# EAGLE design IotaWatt (EAGLE 8.0.0)
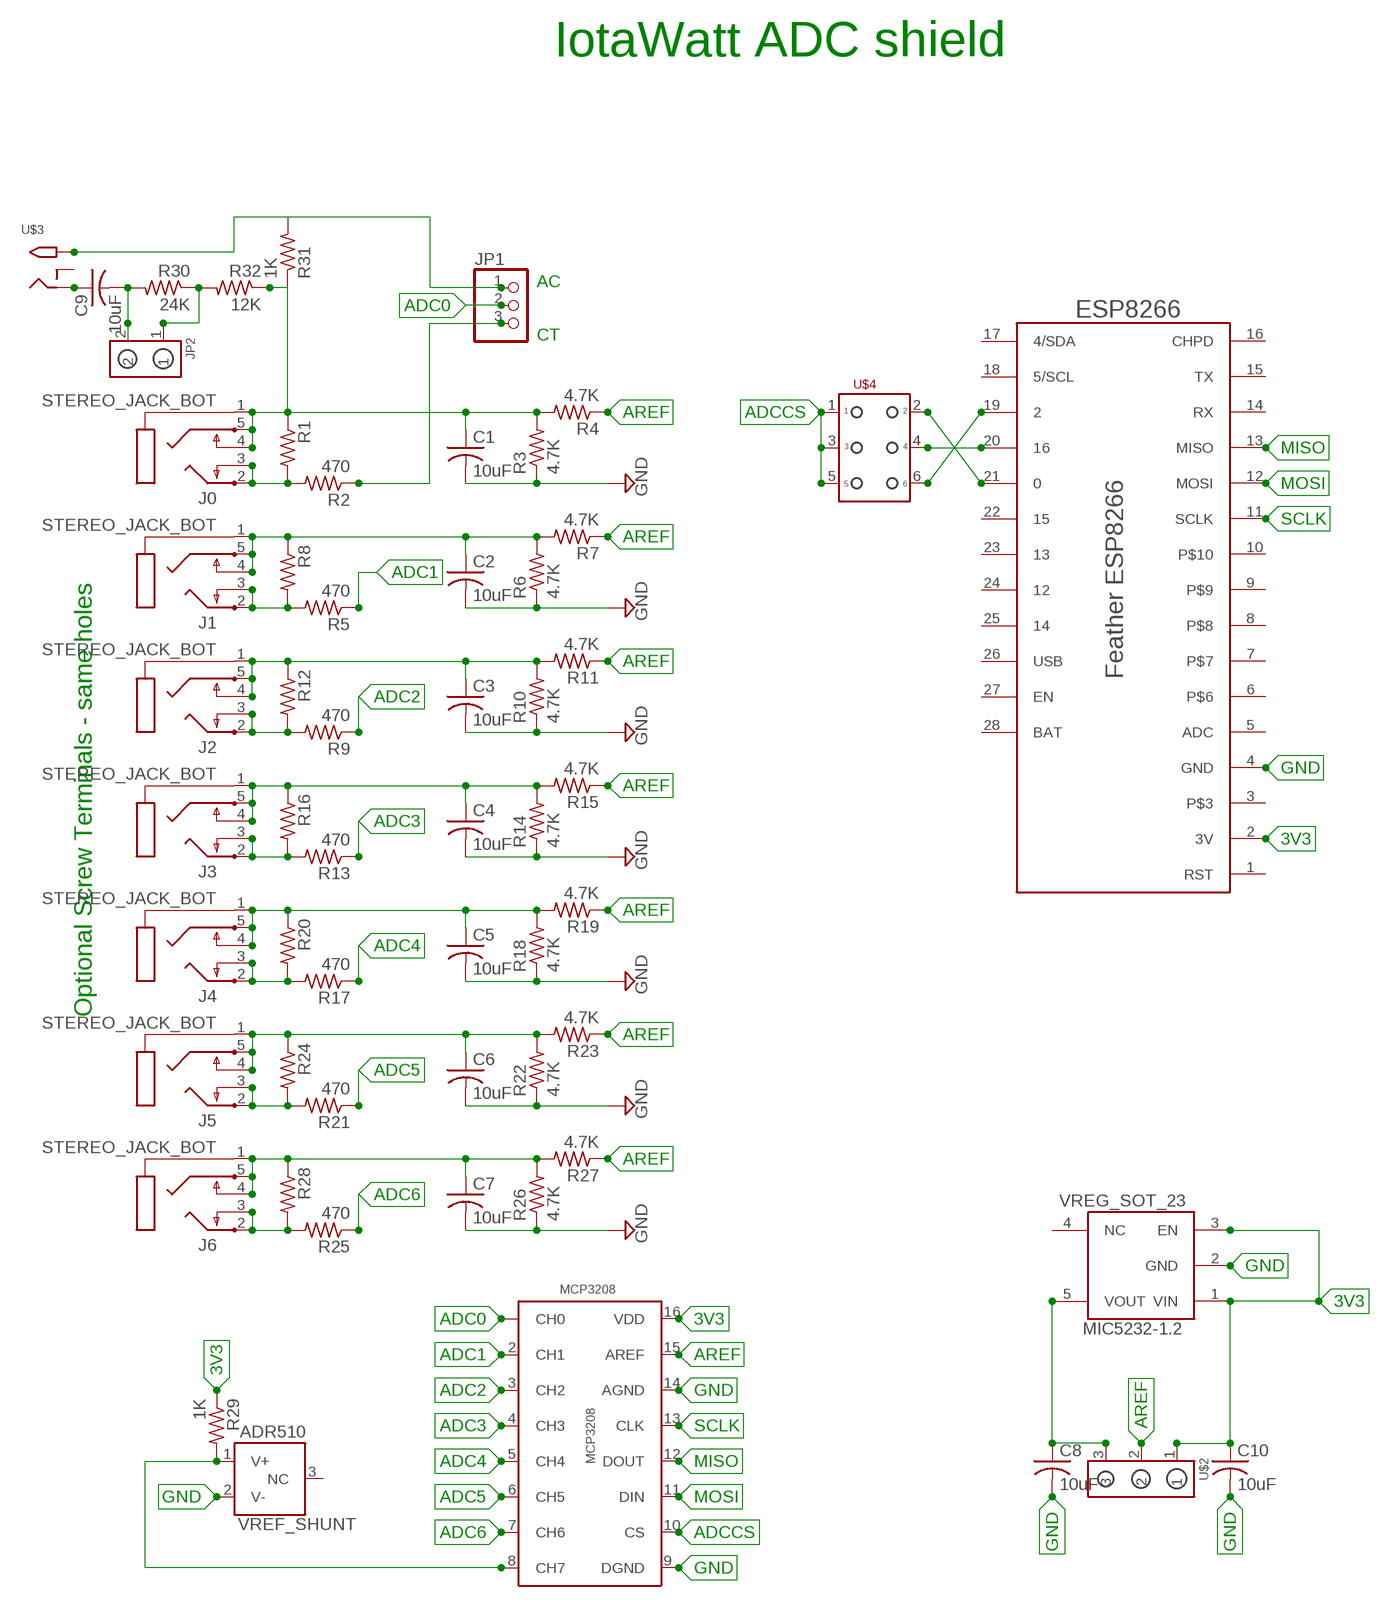
[diagram p0: schematic, sheet 1]

## Parts
ADR510  VREF_SHUNT  [SOT23_3]
C1  10uF  C-USC0805  [C0805]
C2  10uF  C-USC0805  [C0805]
C3  10uF  C-USC0805  [C0805]
C4  10uF  C-USC0805  [C0805]
C5  10uF  C-USC0805  [C0805]
C6  10uF  C-USC0805  [C0805]
C7  10uF  C-USC0805  [C0805]
C8  10uF  C-USC0805  [C0805]
C9  10uF  C-USC0805  [C0805]
C10  10uF  C-USC0805  [C0805]
J0  STEREO_JACK_BOT  [STX3100]
J1  STEREO_JACK_BOT  [STX3100]
J2  STEREO_JACK_BOT  [STX3100]
J3  STEREO_JACK_BOT  [STX3100]
J4  STEREO_JACK_BOT  [STX3100]
J5  STEREO_JACK_BOT  [STX3100]
J6  STEREO_JACK_BOT  [STX3100]
JP1  PINHD-1X3  [1X03]
JP2  HEADER_1X2  [HEADER_1X2]
MCP3208  MCP3208  [SOIC_16]
MIC5232-1.2  VREG_SOT_23  [SOT23_5]
R1  R-US_FLIPFLOP7  [0805-THM-7]
R2  470  R-US_R0805  [R0805]
R3  4.7K  R-US_R0805  [R0805]
R4  4.7K  R-US_R0805  [R0805]
R5  470  R-US_R0805  [R0805]
R6  4.7K  R-US_R0805  [R0805]
R7  4.7K  R-US_R0805  [R0805]
R8  R-US_FLIPFLOP7  [0805-THM-7]
R9  470  R-US_R0805  [R0805]
R10  4.7K  R-US_R0805  [R0805]
R11  4.7K  R-US_R0805  [R0805]
R12  R-US_FLIPFLOP7  [0805-THM-7]
R13  470  R-US_R0805  [R0805]
R14  4.7K  R-US_R0805  [R0805]
R15  4.7K  R-US_R0805  [R0805]
R16  R-US_FLIPFLOP7  [0805-THM-7]
R17  470  R-US_R0805  [R0805]
R18  4.7K  R-US_R0805  [R0805]
R19  4.7K  R-US_R0805  [R0805]
R20  R-US_FLIPFLOP7  [0805-THM-7]
R21  470  R-US_R0805  [R0805]
R22  4.7K  R-US_R0805  [R0805]
R23  4.7K  R-US_R0805  [R0805]
R24  R-US_FLIPFLOP7  [0805-THM-7]
R25  470  R-US_R0805  [R0805]
R26  4.7K  R-US_R0805  [R0805]
R27  4.7K  R-US_R0805  [R0805]
R28  R-US_FLIPFLOP7  [0805-THM-7]
R29  1K  R-US_R0805  [R0805]
R30  24K  R-US_R0805  [R0805]
R31  1K  R-US_R0805  [R0805]
R32  12K  R-US_R0805  [R0805]
U$1  ESP8266FEATHER  [FEATHERWING]
U$2  HEADER_1X3  [HEADER_1X3]
U$3  2.1MMJACKBOTTHM  [PJ-102A-BOT]
U$4  HEADER_2X3  [HEADER_2X3]

## Nets
3V3: C10.1 MCP3208.16(VDD) MIC5232-1.2.1(VIN) MIC5232-1.2.3(EN) R29.1 U$1.2(3V) U$2.1
ACV1: C9.2 JP2.2 R30.2
ACV2: JP2.1 R30.1 R32.2
ADC0: JP1.2 MCP3208.1(CH0)
ADC1: MCP3208.2(CH1) R5.1
ADC2: MCP3208.3(CH2) R9.1
ADC3: MCP3208.4(CH3) R13.1
ADC4: MCP3208.5(CH4) R17.1
ADC5: MCP3208.6(CH5) R21.1
ADC6: MCP3208.7(CH6) R25.1
ADC7: ADR510.1(V+) MCP3208.8(CH7) R29.2
ADCCS: MCP3208.10(CS) U$4.1 U$4.3 U$4.5
AREF: MCP3208.15(AREF) R4.1 R7.1 R11.1 R15.1 R19.1 R23.1 R27.1 U$2.2
GND: ADR510.2(V-) C1.2 C2.2 C3.2 C4.2 C5.2 C6.2 C7.2 C8.2 C10.2 MCP3208.9(DGND) MCP3208.14(AGND) MIC5232-1.2.2(GND) R3.1 R6.1 R10.1 R14.1 R18.1 R22.1 R26.1 U$1.4(GND)
MISO: MCP3208.12(DOUT) U$1.13(MISO)
MOSI: MCP3208.11(DIN) U$1.12(MOSI)
N$1: JP1.3 R2.1
N$2: C1.1 J0.1 J0.4 J0.5 R1.1 R3.2 R4.2 R31.1 R32.1
N$3: U$1.21 U$4.2
N$4: C2.1 J1.1 J1.4 J1.5 R6.2 R7.2 R8.1
N$5: J2.2 J2.3 R9.2 R12.2
N$6: U$1.19 U$4.6
N$7: C9.1 U$3.RING
N$8: JP1.1 R31.2 U$3.TIP
N$9: U$1.20 U$4.4
N$12: C3.1 J2.1 J2.4 J2.5 R10.2 R11.2 R12.1
N$13: C5.1 J4.1 J4.4 J4.5 R18.2 R19.2 R20.1
N$14: J5.2 J5.3 R21.2 R24.2
N$16: C6.1 J5.1 J5.4 J5.5 R22.2 R23.2 R24.1
N$17: J0.2 J0.3 R1.2 R2.2
N$18: J6.2 J6.3 R25.2 R28.2
N$19: C7.1 J6.1 J6.4 J6.5 R26.2 R27.2 R28.1
N$20: J1.2 J1.3 R5.2 R8.2
N$21: J3.2 J3.3 R13.2 R16.2
N$22: C4.1 J3.1 J3.4 J3.5 R14.2 R15.2 R16.1
N$24: C8.1 MIC5232-1.2.5(VOUT) U$2.3
N$26: J4.2 J4.3 R17.2 R20.2
SCLK: MCP3208.13(CLK) U$1.11(SCLK)
Unconnected: ADR510.3(NC) MIC5232-1.2.4(NC) U$1.1(RST) U$1.3 U$1.5(ADC) U$1.6 U$1.7 U$1.8 U$1.9 U$1.10 U$1.14(RX) U$1.15(TX) U$1.16(CHPD) U$1.17(4/SDA) U$1.18(5/SCL) U$1.22 U$1.23 U$1.24 U$1.25 U$1.26(USB) U$1.27(EN) U$1.28(BAT) U$3.RING_SW

## Notes on the sheet
- IotaWatt ADC shield
- AC
- CT
- Optional Screw Terminals - same holes

## Library data of the parts
ADR510 = IotaWatt_parts:VREF_SHUNT: Voltage Reference Shunt - SOT23-3 (ADR504, etc.)
C1-C10 = adafruit:C-US: CAPACITOR, American symbol
J0 J1-J6 = IotaWatt_parts:STEREO_JACK_BOT: Stereo Jack - Bottom Mount
JP1 = adafruit:PINHD-1X3: PIN HEADER
JP2 = IotaWatt_parts:HEADER_1X2: Header 1x2
MCP3208 = IotaWatt_parts:MCP3208: MCP3208 12bit SPI ADC
MIC5232-1.2 = IotaWatt_parts:VREG_SOT_23: Generic SOT23-3 Voltage Regulator (MIC5232, etc.)
R1-R32 = adafruit:R-US_: RESISTOR, American symbol
U$1 = IotaWatt_parts:ESP8266FEATHER: Adafruit ESP8266 Feather
U$2 = IotaWatt_parts:HEADER_1X3
U$3 = IotaWatt_parts:2.1MMJACKBOT: Bottom Mount 2.1mm x 5.5mm THM DC jack with internal switch. Digikey part #PJ-102A, 4UCON part #05537 2.1mm x 5.5mm SMT DC jack with internal switch. Digikey part #PJ-002A-SMT, 4UCON part #03267 By microbuilder.eu & adafruit.com
U$4 = IotaWatt_parts:HEADER_2X3: Header 2x3

## Board
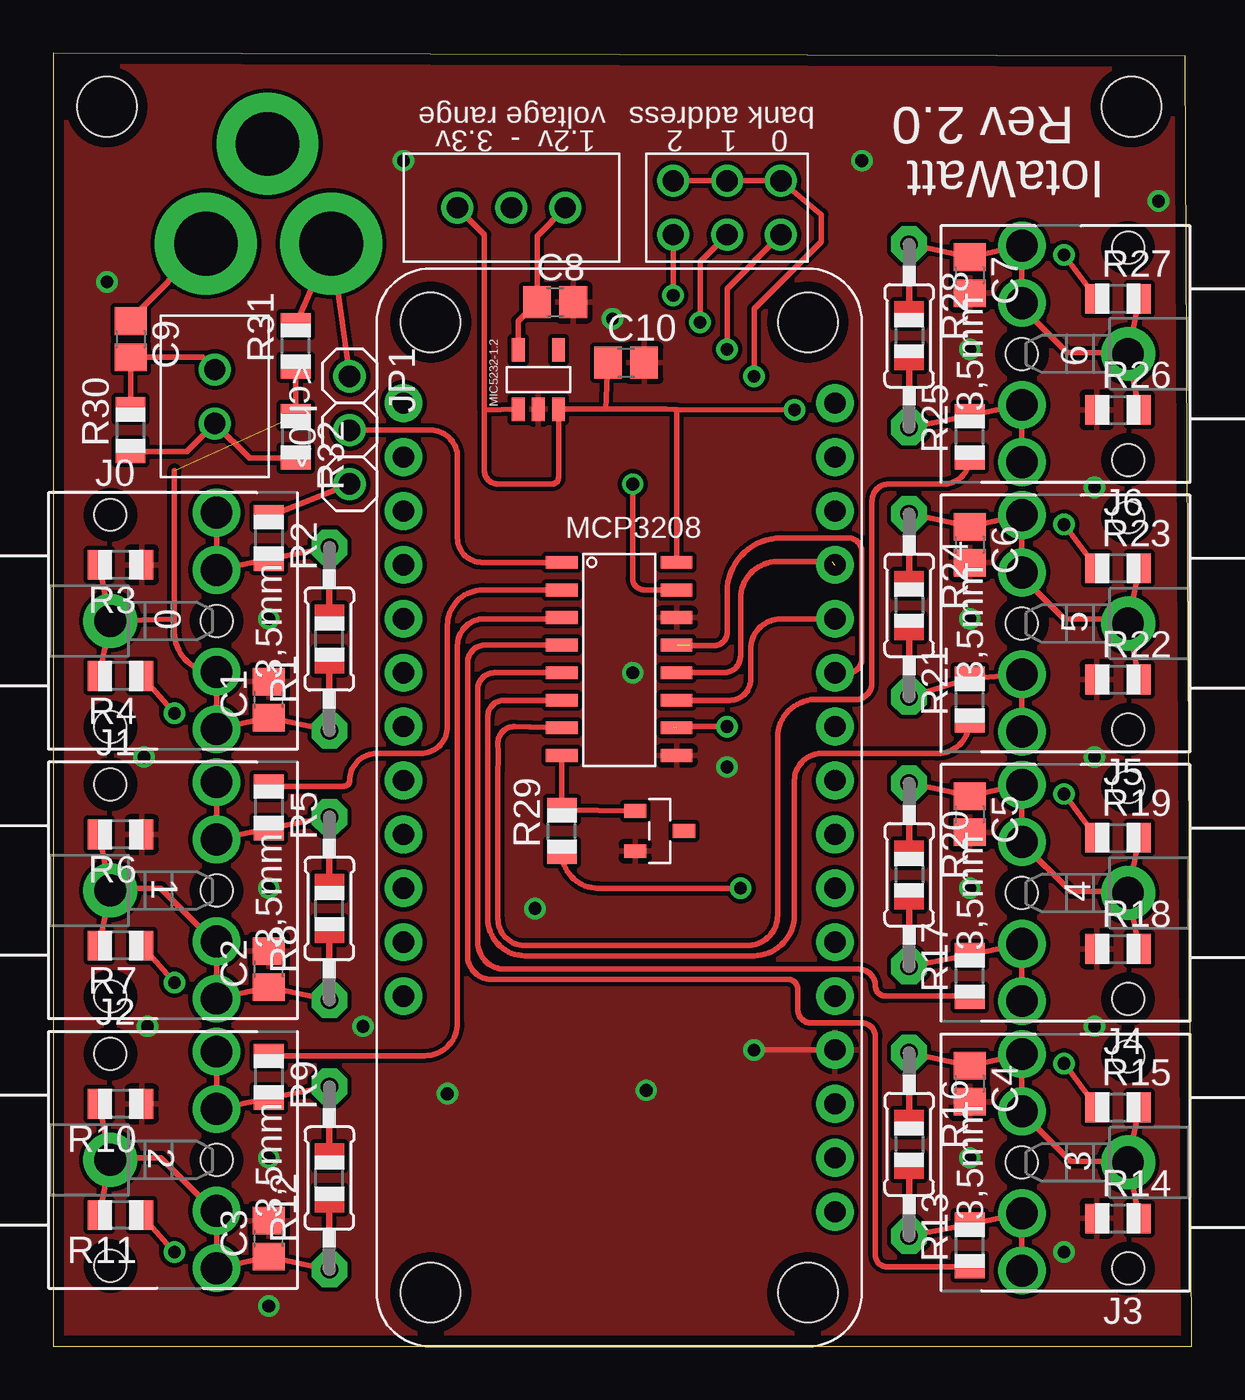
[diagram p1: board, top side]
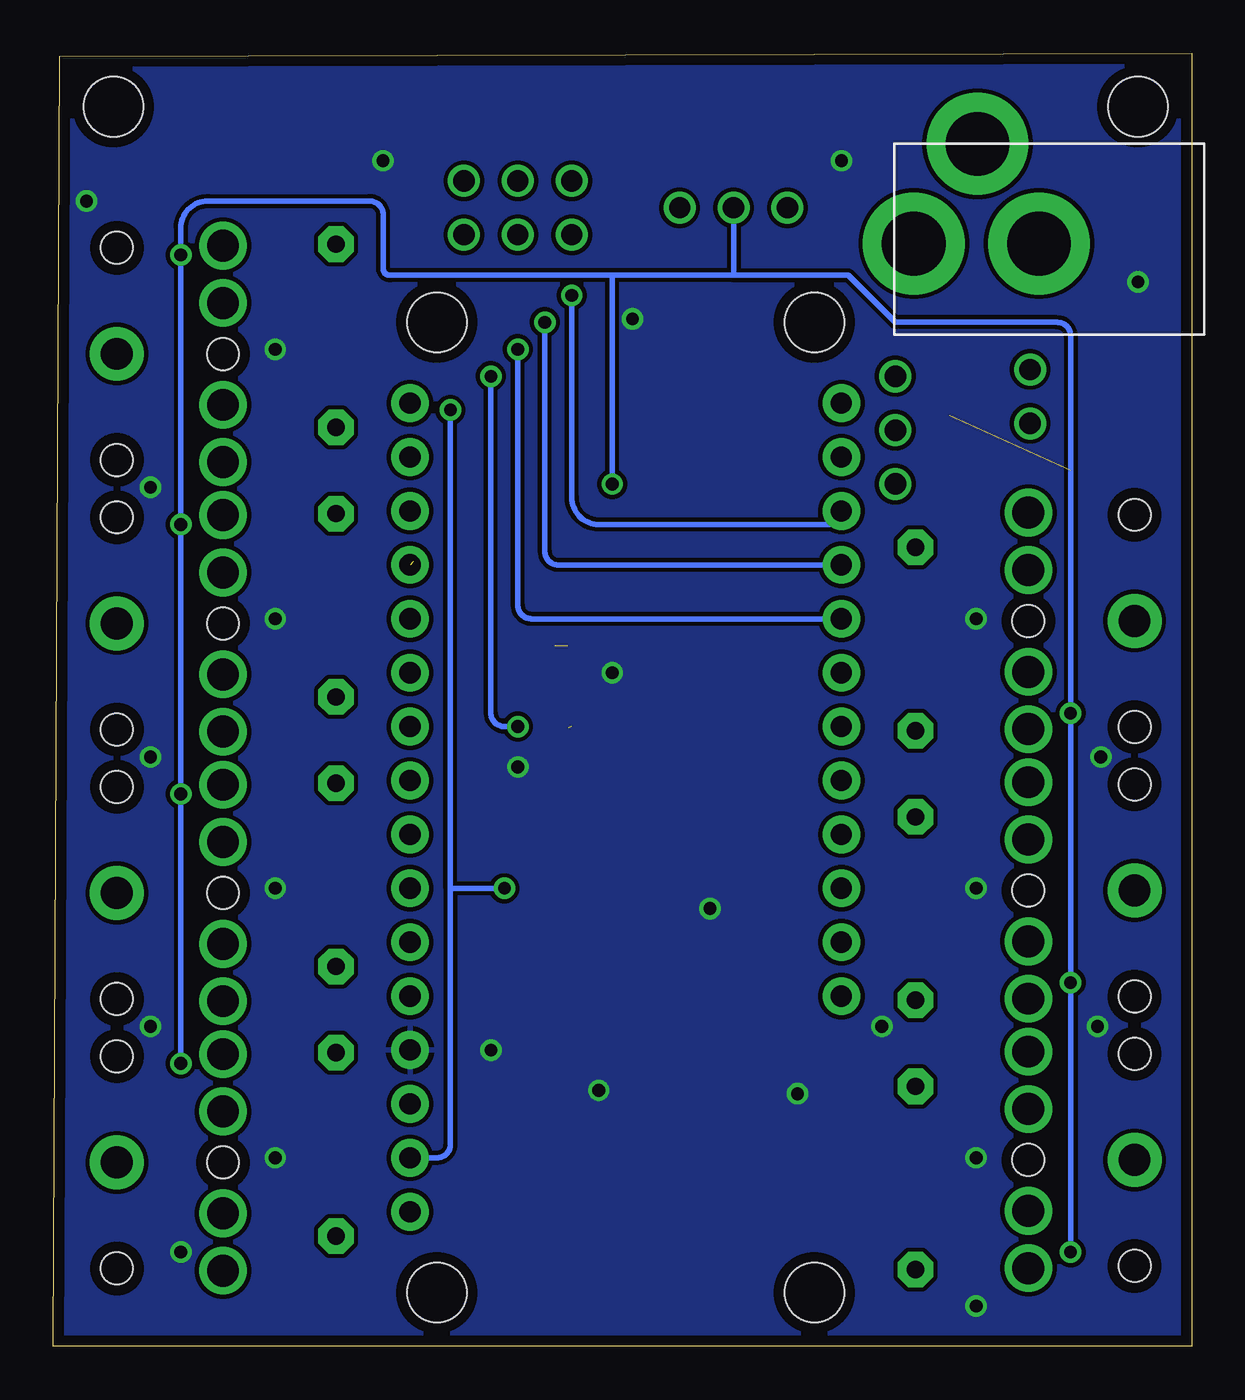
[diagram p2: board, bottom side, seen from below]

Size 53.65 x 60.95 mm. Coordinates in mm from the lower left corner, seen from the top.
Outline: 0,0 53.65,0 53.33,60.79 0,60.95 0,0
Copper layers (1*16): Top 0.035mm / dielectric 1.5mm / Bottom 0.035mm
Design rules "default *": minimum track width 10mil, minimum drill 10mil, track to track 8mil, track to pad 8mil, pad to pad 8mil, via to via 8mil, smd to smd 0mil, copper to edge 20mil, drill to drill 8mil, minimum pad ring 10mil, minimum via ring 8mil, stop-mask expansion 4mil, vias tented up to drill 0mil, thermal gap 10mil
Holes 2.8 mm at 17.78,2.54 35.56,2.54 17.78,48.26 35.56,48.26 2.54,58.42 50.8,58.42

### Footprints (pad centres in the part's own frame; a part is rotated, then mirrored left to right if it is on the bottom)
SOT23_3 = smd 1.05 x 0.65: 1 -1.15,0.95; 2 -1.15,-0.95; 3 1.15,0
C0805 = smd 1.3 x 1.5: 1 -0.85,0; 2 0.85,0
STX3100 = drill 1.5 pad 2.54: 1 2.7,-0.1 | drill 1.5: 2 7.7,5; 3 7.7,2.3; 4 7.7,-2.5; 5 7.7,-5.2 | hole 1.5: 2.7,4.9; 2.7,-5.1; 7.7,-0.1
1X03 = drill 1.016: 1 -2.54,0; 2 0,0; 3 2.54,0
HEADER_1X2 = drill 1: 1 0,2.54; 2 0,0
SOIC_16 = smd 1.5 x 0.6: 1 -2.7,5.2; 2 -2.7,3.9; 3 -2.7,2.6; 4 -2.7,1.3; 5 -2.7,0; 6 -2.7,-1.3; 7 -2.7,-2.6; 8 -2.7,-3.9; 9 2.7,-3.9; 10 2.7,-2.6; 11 2.7,-1.3; 12 2.7,0; 13 2.7,1.3; 14 2.7,2.6; 15 2.7,3.9; 16 2.7,5.2
SOT23_5 = smd 1.1 x 0.6: 1 -1.4,0.95; 2 -1.4,0; 3 -1.4,-0.95; 4 1.4,-0.95; 5 1.4,0.95
0805-THM-7 = drill 0.813 pad 1.676 octagon: 1 -4.318,0; 2 4.318,0
R0805 = smd 1.1 x 1.4: 1 -1,0; 2 1,0
FEATHERWING = drill 1 pad 1.778: 1 6.35,1.27; 2 8.89,1.27; 3 11.43,1.27; 4 13.97,1.27; 5 16.51,1.27; 6 19.05,1.27; 7 21.59,1.27; 8 24.13,1.27; 9 26.67,1.27; 10 29.21,1.27; 11 31.75,1.27; 12 34.29,1.27; 13 36.83,1.27; 14 39.37,1.27; 15 41.91,1.27; 16 44.45,1.27; 17 44.45,21.59; 18 41.91,21.59; 19 39.37,21.59; 20 36.83,21.59; 21 34.29,21.59; 22 31.75,21.59; 23 29.21,21.59; 24 26.67,21.59; 25 24.13,21.59; 26 21.59,21.59; 27 19.05,21.59; 28 16.51,21.59
HEADER_1X3 = drill 1: 1 0,2.54; 2 0,0; 3 0,-2.54
PJ-102A-BOT = drill 3 pad 4.8: RING -0.1,-3.39; RING_SW 4.6,-6.29; TIP -0.1,-9.29
HEADER_2X3 = drill 1: 1 -1.27,2.54; 2 1.27,2.54; 3 -1.27,0; 4 1.27,0; 5 -1.27,-2.54; 6 1.27,-2.54

### Placement (x,y rotation side)
ADR510  28.57,24.29 0 top
C1  10.16,30.48 90 top
C2  10.16,17.78 90 top
C3  10.16,5.08 90 top
C4  43.18,12.38 270 top
C5  43.18,25.08 270 top
C6  43.18,37.78 270 top
C7  43.18,50.48 270 top
C8  23.65,49.21 0 top
C9  3.65,47.47 270 top
C10  26.99,46.35 0 top
J0  0,34.29 0 top
J1  0,21.59 0 top
J2  0,8.89 0 top
J3  53.34,8.57 180 top
J4  53.34,21.27 180 top
J5  53.34,33.97 180 top
J6  53.34,46.67 180 top
JP1  13.97,43.18 270 top
JP2  7.62,46.04 180 top
MCP3208  26.67,31.75 0 top
MIC5232-1.2  22.86,45.56 90 top
R1  13.02,33.34 90 top
R2  10.16,38.1 270 top
R3  3.17,36.83 180 top
R4  3.17,31.59 180 top
R5  10.16,25.4 270 top
R6  3.17,24.13 180 top
R7  3.17,18.89 180 top
R8  13.02,20.64 90 top
R9  10.16,12.7 270 top
R10  3.17,11.43 180 top
R11  3.17,6.19 180 top
R12  13.02,7.94 90 top
R13  43.18,4.76 90 top
R14  50.16,6.03 0 top
R15  50.16,11.27 0 top
R16  40.32,9.53 270 top
R17  43.18,17.46 90 top
R18  50.16,18.73 0 top
R19  50.16,23.97 0 top
R20  40.32,22.23 270 top
R21  43.18,30.48 90 top
R22  50.16,31.43 0 top
R23  50.16,36.67 0 top
R24  40.32,34.92 270 top
R25  43.18,42.86 90 top
R26  50.16,44.13 0 top
R27  50.16,49.37 0 top
R28  40.32,47.62 270 top
R29  23.97,24.29 90 top
R30  3.65,43.18 90 top
R31  11.43,47.15 90 top
R32  11.43,42.86 270 top
U$1  38.1,0 90 top
U$2  21.59,53.66 90 top
U$3  3.81,52.07 90 top
U$4  31.75,53.66 270 top

### Tracks (layer width: path | path; a pad name or v marks a point on that pad's centre or on a via)
3V3  (via drill 0.6)
  Top 0.254: R29.1 arc90 25.67,21.59 v32.38,21.59 | 20.32,44.13 20.32,50.8 | 20.32,50.8 20.32,51.12 | 20.32,44.13 20.32,41.27 arc90 20.95,40.64 23.5,40.64 arc90 23.81,40.95 MIC5232-1.2.3 26.04,44.16 | MIC5232-1.2.1 20.32,44.13 | 26.04,44.16 28.86,44.16 29.37,44.16 | 29.21,37.11 arc90 MCP3208.16 | 26.04,44.16 C10.1 | 29.37,44.16 v34.92,44.13 | MCP3208.16 | MCP3208.16 29.37,44.16 | 20.32,50.8 20.32,52.39 U$2.1
  Bottom 0.254: U$1.2 35.56,8.89 arc-90 34.92,9.53 34.92,21.59 | 34.92,21.59 v34.92,44.13 | v32.38,21.59 34.92,21.59
ACV1
  Top 0.254: R30.2 C9.2 7.04,46.62 JP2.2
ACV2
  Top 0.254: R30.1 6.3,42.18 JP2.1 9.26,41.86 R32.2
ADC0
  Top 0.254: JP1.2 arc-90 13.65,43.18 17.78,43.18 arc-90 19.05,41.91 19.05,38.1 arc90 20.2,36.95 MCP3208.1
ADC1
  Top 0.254: R5.1 13.7,26.4 arc90 13.97,26.67 arc-90 15.24,27.94 17.3,27.94 arc90 18.57,29.21 18.57,33.97 arc-90 20.25,35.65 MCP3208.2
ADC2
  Top 0.254: R9.1 17.51,13.7 arc90 19.05,15.24 19.05,33.02 arc-90 20.32,34.29 23.91,34.29 arc90 MCP3208.3
ADC3
  Top 0.254: 43.13,3.33 arc-90 R13.1 39.26,3.76 arc-90 38.73,4.29 38.73,14.61 arc90 38.1,15.24 35.72,15.24 arc-90 35.08,15.88 35.08,16.83 arc90 34.61,17.3 20.64,17.3 arc-90 19.53,18.41 19.53,32.23 arc-90 20.35,33.05 MCP3208.4
ADC4
  Top 0.254: R17.1 arc90 43.13,16.51 39.21,16.51 arc-90 38.73,16.99 arc90 37.94,17.78 21.27,17.78 arc-90 20,19.05 20,30.96 arc-90 20.8,31.75 MCP3208.5
ADC5
  Top 0.254: R21.1 arc-90 41.64,27.94 36.2,27.94 arc90 34.92,26.67 34.92,20.32 arc-90 33.02,18.41 22.23,18.41 arc-90 20.48,20.16 20.48,29.69 arc-90 21.24,30.45 MCP3208.6
ADC6
  Top 0.254: R25.1 arc-90 41.96,40.64 39.37,40.64 arc90 38.58,39.85 38.58,31.27 arc-90 37.78,30.48 36.2,30.48 arc90 34.13,28.89 34.13,20.32 arc-90 32.7,18.89 22.23,18.89 arc-90 20.95,20.16 20.95,27.15 arc3 20.95,28.42 arc-93 21.75,29.21 arc0 MCP3208.7
ADC7
  Top 0.254: MCP3208.8 R29.2 ADR510.1
ADCCS  (via drill 0.6)  (1 unrouted)
  Top 0.254: U$4.5 U$4.3 U$4.1 36.2,53.34 36.2,52.07 33.02,48.9 v33.02,45.72 | v31.75,29.21 29.21,29.21
  Bottom 0.254: v31.75,29.21 32.38,29.21 arc90 33.02,29.84 v33.02,45.72
AREF  (via drill 0.6)
  Top 0.254: R11.1 v5.71,4.45 | R7.1 v5.71,17.14 | R4.1 v5.71,29.84 | R23.1 v47.62,38.73 | R19.1 v47.62,26.04 | R15.1 v47.62,13.34 | R27.1 v47.62,51.44 | MCP3208.15 27.85,35.65 arc-90 27.3,36.2 v27.3,40.64
  Bottom 0.254: v47.62,13.34 v47.62,26.04 v47.62,38.73 v47.62,51.44 47.62,52.7 arc90 46.35,53.98 38.73,53.98 arc90 38.1,53.34 38.1,50.8 arc-90 37.78,50.48 27.3,50.48 | v5.71,4.45 v5.71,17.14 v5.71,29.84 5.71,47.62 arc-90 6.35,48.26 13.97,48.26 16.19,50.48 21.59,50.48 | 21.59,50.48 27.3,50.48 | v27.3,40.64 27.3,50.48 | U$2.2 21.59,50.48
GND  (via drill 0.6)
  Top 0.254: v33.02,13.97 U$1.4
  other vias: 52.07,53.98 27.94,12.06 2.54,50.16 10.16,1.91 26.35,48.42 4.29,27.78 14.61,15.08 43.18,8.89 43.18,21.59 43.18,34.29 43.18,46.99 10.16,21.59 10.16,34.29 10.16,8.89 4.45,15.08 49.05,15.08 49.05,27.78 49.05,40.48 47.62,4.45 18.57,11.91 22.7,20.64 31.75,27.3 27.3,31.75 16.51,55.88 38.1,55.88
  pour Top: 0,60.96 0,0 53.34,0 53.34,60.96
  pour Bottom: 0,0 0,60.96 53.34,60.96 53.34,-0.64
MISO  (1 unrouted)
  Top 0.254: 36.67,36.99 34.13,36.99 arc90 32.38,35.24 32.38,32.54 arc-90 31.59,31.75 MCP3208.12
MOSI
  Top 0.254: MCP3208.11 31.88,30.45 arc90 32.86,31.43 32.86,32.86 arc-90 34.29,34.29 U$1.12
N$1
  Top 0.254: R2.1 JP1.3
N$2  (1 unrouted)
  Top 0.254: R4.2 J0.1 | J0.1 R3.2 | 2.8,34.29 arc90 J0.1 | 5.71,34.29 5.71,41.27 | 5.71,34.29 5.71,33.66 arc90 7.58,31.79 J0.4 J0.5 C1.1 R1.1 | J0.1 5.71,34.29 | R31.1 R32.1
N$3  (via drill 0.6)
  Top 0.254: v31.75,46.99 31.75,49.85 U$4.2
  Bottom 0.254: U$1.21 31.11,34.29 arc90 31.75,34.92 v31.75,46.99
N$4
  Top 0.254: J1.1 R7.2 | J1.1 R6.2 | R8.1 C2.1 J1.5 J1.4 7.58,19.09 5.08,21.59 2.8,21.59 J1.1
N$5
  Top 0.254: J2.2 J2.3 R9.2 R12.2
N$6  (via drill 0.6)
  Top 0.254: v29.21,49.53 U$4.6
  Bottom 0.254: U$1.19 arc90 17.14,38.73 27.94,38.73 arc90 29.21,40.01 v29.21,49.53
N$7
  Top 0.254: C9.1 3.65,48.42 U$3.RING
N$8
  Top 0.254: JP1.1 U$3.TIP R31.2
N$9  (via drill 0.6)
  Top 0.254: v30.48,48.26 30.48,51.12 U$4.4
  Bottom 0.254: U$1.20 29.84,36.83 arc90 30.48,37.47 v30.48,48.26
N$12
  Top 0.254: J2.1 R11.2 | J2.1 R10.2 | R12.1 C3.1 J2.5 J2.4 7.58,6.39 5.08,8.89 2.8,8.89 J2.1
N$13
  Top 0.254: R20.1 C5.1 J4.5 J4.4 45.64,23.73 47.94,21.43 50.58,21.43 J4.1 | R19.2 J4.1 | R18.2 J4.1
N$14
  Top 0.254: J5.2 J5.3 R21.2 R24.2
N$16
  Top 0.254: R24.1 C6.1 J5.5 J5.4 45.64,36.27 47.62,34.29 50.42,34.29 J5.1 | J5.1 R23.2 | R22.2 J5.1
N$17
  Top 0.254: J0.2 J0.3 R2.2 R1.2
N$18
  Top 0.254: R28.2 R25.2 J6.3 J6.2
N$19
  Top 0.254: R28.1 C7.1 J6.5 J6.4 45.64,48.98 47.78,46.83 50.58,46.83 J6.1 | R27.2 J6.1 | R26.2 J6.1
N$20
  Top 0.254: J1.2 J1.3 R5.2 R8.2
N$21
  Top 0.254: J3.2 J3.3 R13.2 R16.2
N$22
  Top 0.254: R16.1 C4.1 J3.5 J3.4 45.64,11.03 47.94,8.73 50.58,8.73 J3.1 | R15.2 J3.1 | R14.2 J3.1
N$24
  Top 0.254: MIC5232-1.2.5 21.91,48.32 C8.1 22.8,52.33 U$2.3
N$26
  Top 0.254: R20.2 R17.2 J4.3 J4.2
SCLK  (1 unrouted)
  Top 0.254: MCP3208.13 arc90 29.4,33.02 | 30,33.02 31.11,33.02 arc90 31.75,33.66 31.75,35.56 arc-90 34.29,38.1 37.47,38.1 arc-90 38.1,37.47 38.1,32.38 arc-90 37.47,31.75 U$1.11

### Text on the board
tPlace: voltage range | bank address | Rev 2.0 | 1.2v - 3.3v | 2 | 1 | 0 | IotaWatt | <ch0> | 6 | 0 | 5 | 1 | 4 | 2 | 3